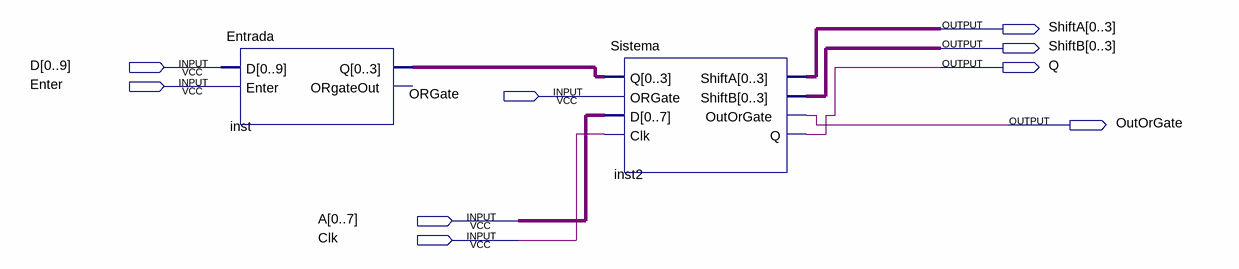
[diagram p0: schematic sheet]
// Quartus schematic testes.bdf as structural Verilog: 2 symbols, 9 pins
module testes (
  input  [0:9] D,
  input  Enter,
  input  ORGate,
  input  [0:7] A,
  input  Clk,
  output [0:3] ShiftA,
  output [0:3] ShiftB,
  output Q,
  output OutOrGate
);

  wire [3:0] inst_q;

  Entrada inst (.Q(inst_q));  // open: D, Enter, ORgateOut
  Sistema inst2 (
    .Q({inst_q[0], inst_q[1], inst_q[2], inst_q[3], Q}), .ORGate(ORGate), .D(A), .Clk(Clk), .ShiftA(ShiftA),
    .ShiftB(ShiftB), .OutOrGate(OutOrGate));
endmodule
